# EasyEDA Pro project IMU-V2.eprj

# Schematic Schematic1
Create Date: 2023-02-26; Page Name: P1; Project Name: IMU-V2; Schematic Name: Schematic1; Update Date: 2023-03-20; Company: 嘉立创EDA; Page Size: A4; Version: V1.0
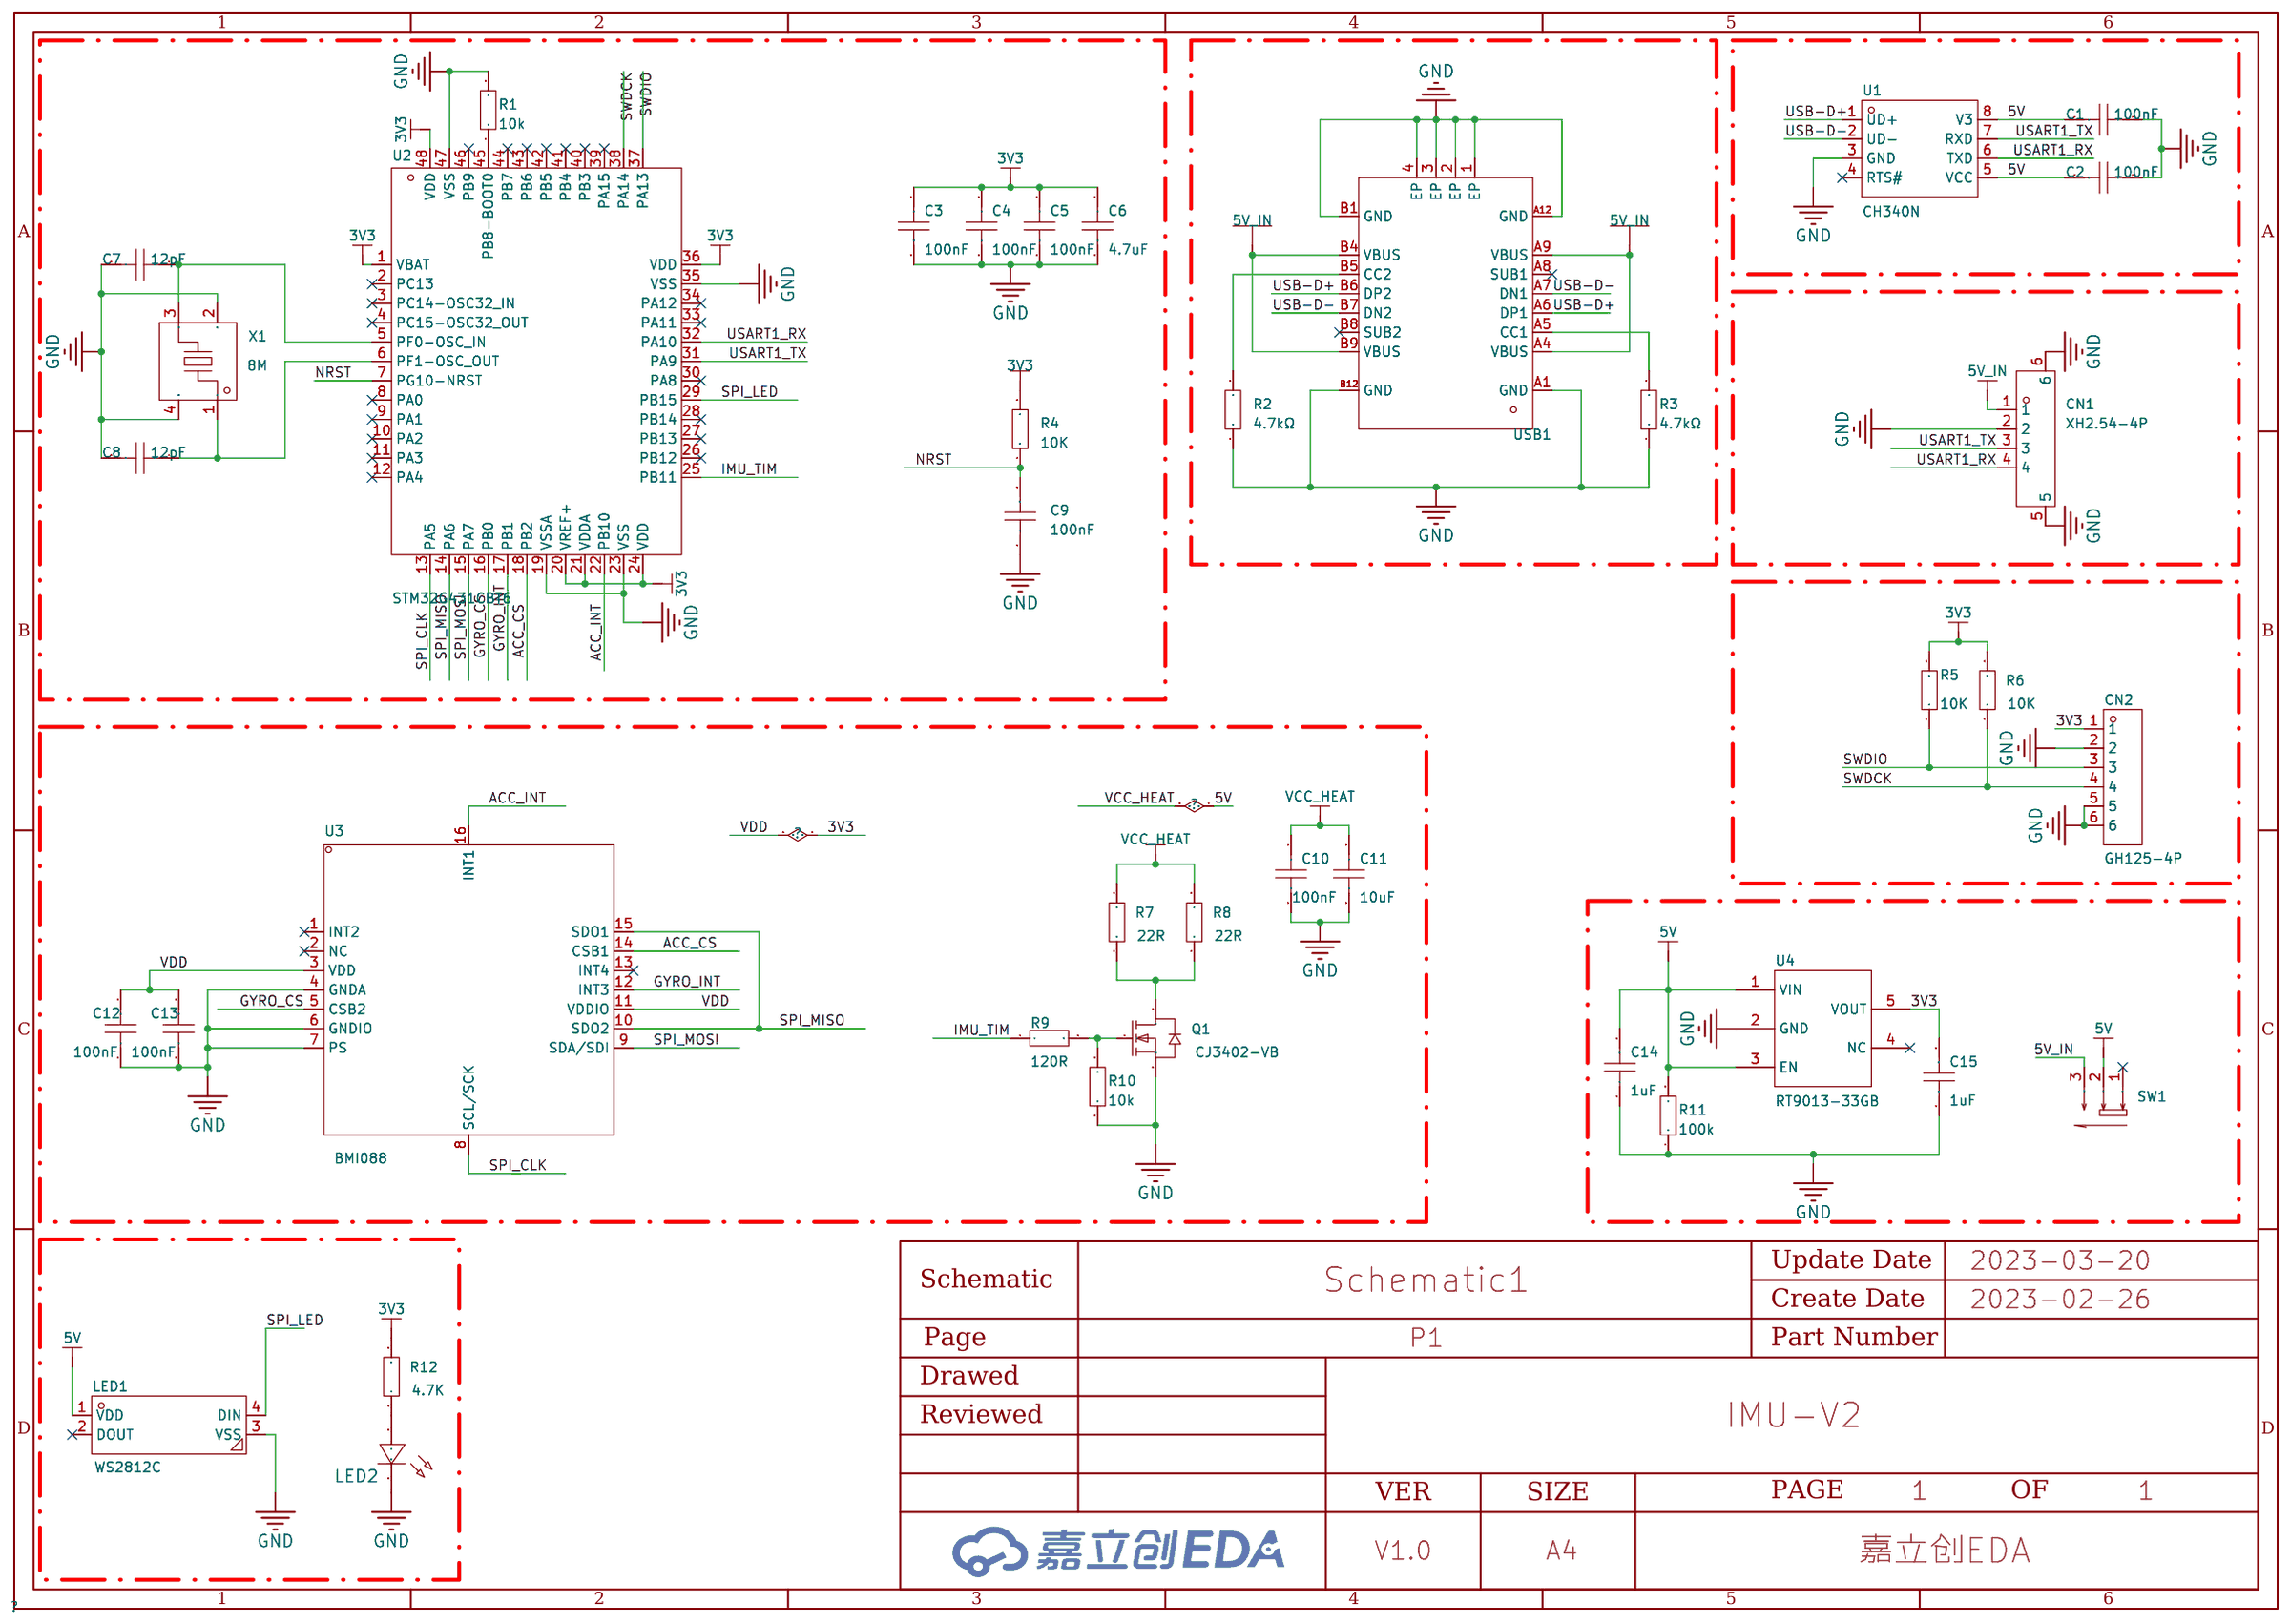
[diagram p0: schematic sheet]

## Parts
C1  100nF  [C0603_1]
C2  100nF  [C0603_1]
C3  100nF  [C0603]
C4  100nF  [C0603]
C5  100nF  [C0603]
C6  4.7uF  [C0603]
C7  12pF  [C0603]
C8  12pF  [C0603]
C9  100nF  [C0603_1]
C10  100nF  [C0603]
C11  10uF  [C0603]
C12  100nF  [C0603]
C13  100nF  [C0603]
C14  1uF  [C0603_1]
C15  1uF  [C0603_1]
CN1  XH2.54-4P  [CONN-TH_4P-P0.20_XUNPU_WAFER-XH2.54-4PWB]
CN2  GH125-4P  [CONN-SMD_4P-P1.27_GH125-S04DCA-00]
LED1  WS2812C  [LED-SMD_4P-L5.0-W5.0-LS5.4-TL-1]
LED2  -  [LED_0603]
Q1  CJ3402-VB  [SOT-23-3_L2.9-W1.6-P1.90-LS2.8-BR]
R1  10k  [R0603]
R2  4.7kΩ  [R0603]
R3  4.7kΩ  [R0603]
R4  10K  [R0603_2]
R5  10K  [R0603_3]
R6  10K  [R0603_3]
R7  22R  [R1206]
R8  22R  [R1206]
R9  120R  [R0603]
R10  10k  [R0603]
R11  100k  [R0603]
R12  4.7K  [R0603]
SW1  JS102011SAQN  [SW-SMD_JS102011SAQN]
U1  CH340N  [SOP-8_L4.9-W3.9-P1.27-LS6.0-BL]
U2  STM32G431CBT6  [LQFP-48_L7.0-W7.0-P0.50-LS9.0-BL_1]
U3  BMI088  [LGA-16_L4.5-W3.0-P0.50-BL]
U4  RT9013-33GB  [SOT-23-5_L3.0-W1.7-P0.95-LS2.8-BL]
USB1  -  [USB-C-SMD_KH-TYPE-C-16P_1]
X1  8M  [CRYSTAL-SMD_4P-L3.2-W2.5-BL_1]

## Library data of the parts
C1 C2 C9 C14 C15 = CAP_604: Supplier Footprint: 0603; Check: true
C3-C8 C10-C13 = CAP_0603: Supplier Footprint: 0603; Check: true
CN1 = WAFER-XH2.54-4PWB: LCSC Part Name: XH2.54mm 4P 卧贴; Supplier Part: C3029478; Manufacturer: XUNPU(讯普); Supplier Footprint: SMD,P=2.5mm; JLCPCB Part Class: Extended Part; Datasheet: https://atta.szlcsc.com/upload/public/pdf/source/20220527/7ACD2214A426F03D9ACD52F5A71E518C.pdf; Supplier: LCSC; Check: true
CN2 = GH125-S04DCA-00: 参考系列:-;间距:1.25mm;插针结构:1x4P;排数:1;每排PIN数:4;行距:-;公母:公型插针;安装方式:卧贴;额定电流:1A;工作温度范围:-25℃~+85℃;; LCSC Part Name: 1.25mm 1x4P 卧贴; Supplier Part: C2886767; Manufacturer: JS(钜硕电子); Supplier Footprint: SMD,P=1.25mm; JLCPCB Part Class: Extended Part; Datasheet: https://atta.szlcsc.com/upload/public/pdf/source/20210818/CD11791E5ED3EDF45A7009E9C8A2BD4C.pdf; Supplier: LCSC; Pitch: 1.25mm; Pins Structure: 1x4P; Number of Rows: 1; Number of PINs Per Row: 4; Gender: 公型插针; Mounting Style: 卧贴; Current Rating (Max): 1A; Operating Temperature Range: -25℃~+85℃; Check: true
LED1 = WS2812C: 发光颜色:RGB三色;; LCSC Part Name: RGB三色 （注意防潮，请查阅规格书中对应具体内容）; Supplier Part: C114587; Manufacturer: worldsemi; Supplier Footprint: SMD5050; JLCPCB Part Class: Extended Part; Datasheet: https://atta.szlcsc.com/upload/public/pdf/source/20171019/C114587_15083980074721044737.pdf; Supplier: LCSC; Emitted Color: RGB三色
LED2 = LED_0603-R: Supplier Footprint: 0603; Check: true
Q1 = CJ3402-VB: 类型:N沟道;漏源电压(Vdss):30V;连续漏极电流(Id):6.5A;功率(Pd):-;导通电阻(RDS(on)@Vgs,Id):30mΩ@10V,6.5A;阈值电压(Vgs(th)@Id):-;栅极电荷(Qg@Vgs):-;输入电容(Ciss@Vds):-;反向传输电容(Crss@Vds):-;; LCSC Part Name: N沟道 30V 6.5A; Supplier Part: C709940; Manufacturer: VBsemi(微碧); Supplier Footprint: SOT-23; JLCPCB Part Class: Extended Part; Datasheet: https://atta.szlcsc.com/upload/public/pdf/source/20200723/C709940_FC7E0D7FD36813A0D48B4CA5756C6C42.pdf; Supplier: LCSC; Type: N沟道; Drain Source Voltage (Vdss): 30V; Continuous Drain Current (Id): 6.5A; Drain Source On Resistance (RDS(on)@Vgs,Id): 30mΩ@10V,6.5A; Check: true
R1-R3 = RMC04025.1K5%N: 阻值:5.1kΩ;精度:±5%;功率:1/16W;; LCSC Part Name: 5.1kΩ ±5% 1/16W; Supplier Part: C325524; Manufacturer: Tyohm(幸亚电阻); Supplier Footprint: 0402; JLCPCB Part Class: Extended Part; Datasheet: https://atta.szlcsc.com/upload/public/pdf/source/20190115/C325524_522AE7765A4DE6F7DC0B90EDB62F83C2.pdf; Supplier: LCSC; Tolerance: ±5%; Power(Watts): 1/16W; Check: true
R4 = Res_605: Supplier Footprint: 0603; Check: true
R5 R6 = Res_606: Supplier Footprint: 0603
R7 R8 = Res_1206: Supplier Footprint: 1206
R9-R12 = Res_0603: Supplier Footprint: 0603; Check: true
SW1 = JS102011SAQN: 额定电流(DC):300mA;额定电压(DC):6V;额定电流(AC):-;额定电压(AC):-;电路结构:单刀双掷;安装方式:卧贴;机械寿命:5000;滑钮形状:矩形柱状;引脚样式:SMD接片;工作温度:-40℃~+85℃;开关高度:-;; Supplier Part: C221660; Manufacturer: C&K; Supplier Footprint: SMD; JLCPCB Part Class: Extended Part; Datasheet: https://atta.szlcsc.com/upload/public/pdf/source/20180724/C221660_DE1FE6FB2A421E3FF136514ED50A85B2.pdf; Supplier: LCSC; Current Rating (DC): 300mA; Voltage Rating (DC): 6V; Circuit: 单刀双掷; Mounting Style: 卧贴; Mechanical Life: 5000; Actuator Style: 矩形柱状; Pin Style: SMD接片; Operating Temperature: -40℃~+85℃
U1 = CH340N: Supplier Part: C2977777; Manufacturer: WCH(南京沁恒); Supplier Footprint: SOP-8; JLCPCB Part Class: Extended Part; Datasheet: https://atta.szlcsc.com/upload/public/pdf/source/20220223/82A45E4FF89B3EDCAD50B354450A7EF4.pdf; Supplier: LCSC; Check: true
U2 = STM32G431CBT6_1: CPU内核:ARM Cortex-M4;CPU最大主频:170MHz;工作电压范围:1.71V~3.6V;程序存储容量:128KB;RAM总容量:32KB;EEPROM/数据 FLASH容量:128KB;GPIO端口数量:38;ADC(位数):12bit;DAC(位数):12bit;(E)PWM(位数):-;外设/功能:DMA；PWM；看门狗;内部振荡器:有;工作温度范围:-40℃~+85℃;; LCSC Part Name: ARM Cortex-M4 170MHz; Supplier Part: C529355; Manufacturer: ST(意法半导体); Supplier Footprint: LQFP-48(7x7); JLCPCB Part Class: Extended Part; Datasheet: https://atta.szlcsc.com/upload/public/pdf/source/20200511/C529354_7C66CF00837B904D0C15DCE45B69418C.pdf; Supplier: LCSC; CPU Core: ARM Cortex-M4; CPU Maximum Speed: 170MHz; Operating Voltage Range: 1.71V~3.6V; Program Storage Size: 128KB; Program Memory Type: FLASH; RAM Size: 32KB; EEPROM: 128KB; GPIO Ports Number: 38; ADC (Bit): 12bit; DAC (Bit): 12bit; Peripheral/Function: DMA；PWM；看门狗; Internal Oscillator: 有; Operating Temperature Range: -40℃~+85℃
U3 = BMI088: Supplier Part: C194919; Manufacturer: Bosch(博世); Supplier Footprint: LGA-16; JLCPCB Part Class: Extended Part; Datasheet: https://atta.szlcsc.com/upload/public/pdf/source/20180628/C194919_66CCF125FF968C218A4D358C68AC68D6.pdf; Supplier: LCSC; Check: true
U4 = RT9013-33GB: 输出类型:固定;输出极性:正;输出通道数:1;最大输入电压:5.5V;输出电压:3.3V;压差:400mV@(500mA);静态电流(地电流):-;输出电流:500mA;电源纹波抑制比(PSRR):50dB@(10kHz);噪声:-;特性:-;; LCSC Part Name: 正 Vin=5.5V Vout=3.3V 500mA 50dB@(10kHz); Supplier Part: C47773; Manufacturer: RICHTEK(立锜); Supplier Footprint: SOT-23-5; JLCPCB Part Class: Extended Part; Datasheet: https://atta.szlcsc.com/upload/public/pdf/source/20150504/1457707282459.pdf; Supplier: LCSC; Output Type: 固定; Output Polarity: 正; Number of Outputs: 1; Maximum Input Voltage: 5.5V; Output Voltage: 3.3V; Dropout Voltage: 400mV@(500mA); Output Current: 500mA; Power Supply Rejection Ratio (PSRR): 50dB@(10kHz)
USB1 = kh-type-c-16p_2: Type-C母座 16PIN 立式四角贴板无压片; LCSC Part Name: Type-C母座; Supplier Part: C709357; Manufacturer: kinghelm(金航标); Manufacturer Part: KH-TYPE-C-16P; LCSC Stock: 5637; LCSC On Sale: 1; Price: 0.484; JLCPCB Part Class: Extended Part; JLCPCB Stock: 2220; JLCPCB On Sale: 1; Datasheet: https://atta.szlcsc.com/upload/public/pdf/source/20200911/C709357_AA8DCEB38BB20E3035A7ED7AE7667837.pdf; Supplier: LCSC; Check: true
X1 = 3225-12-16-10-10/A_1: 工作温度-40℃~+95℃; LCSC Part Name: 3225-12-16-10-10/A; Supplier Part: C2981641; Manufacturer: LIMING(利明); Supplier Footprint: SMD3225-4P; JLCPCB Part Class: Extended Part; Datasheet: https://atta.szlcsc.com/upload/public/pdf/source/20220322/0ABBC579650689231413FB26C3617F3F.pdf; Supplier: LCSC; Check: true

## Nets
3V3: C3.1 C4.1 C5.1 C6.1 C12.2 C13.2 C15.2 CN2.1 R4.2 R5.2 R6.2 R12.2 U2.1(VBAT) U2.20(VREF+) U2.21(VDDA) U2.24(VDD) U2.36(VDD) U2.48(VDD) U3.3(VDD) U3.11(VDDIO) U4.5(VOUT)
5V: C1.2 C2.2 C10.1 C11.1 C14.2 LED1.1(VDD) R7.2 R8.2 R11.2 SW1.2 U1.5(VCC) U1.8(V3) U4.1(VIN) U4.3(EN)
5V_IN: CN1.1 SW1.3 USB1.A4(VBUS) USB1.A9(VBUS) USB1.B4(VBUS) USB1.B9(VBUS)
GND: C1.1 C2.1 C3.2 C4.2 C5.2 C6.2 C7.2 C8.2 C9.1 C10.2 C11.2 C12.1 C13.1 C14.1 C15.1 CN1.2 CN1.5 CN1.6 CN2.2 CN2.5 CN2.6 LED1.3(VSS) LED2.1(C) Q1.2(S) R1.2 R2.1 R3.1 R10.1 R11.1 U1.3(GND) U2.19(VSSA) U2.23(VSS) U2.35(VSS) U2.47(VSS) U3.4(GNDA) U3.6(GNDIO) U3.7(PS) U4.2(GND) USB1.1(EP) USB1.2(EP) USB1.3(EP) USB1.4(EP) USB1.A1(GND) USB1.A12(GND) USB1.B1(GND) USB1.B12(GND) X1.2(GND) X1.4(GND)
ACC_CS: U2.18(PB2) U3.14(CSB1)
ACC_INT: U2.22(PB10) U3.16(INT1)
GYRO_CS: U2.16(PB0) U3.5(CSB2)
GYRO_INT: U2.17(PB1) U3.12(INT3)
IMU_TIM: R9.1 U2.25(PB11)
NRST: C9.2 R4.1 U2.7(PG10-NRST)
SPI_CLK: U2.13(PA5) U3.8(SCL/SCK)
SPI_LED: LED1.4(DIN) U2.29(PB15)
SPI_MISO: U2.14(PA6) U3.10(SDO2) U3.15(SDO1)
SPI_MOSI: U2.15(PA7) U3.9(SDA/SDI)
SWDCK: CN2.4 R6.1 U2.38(PA14)
SWDIO: CN2.3 R5.1 U2.37(PA13)
USART1_RX: CN1.4 U1.6(TXD) U2.32(PA10)
USART1_TX: CN1.3 U1.7(RXD) U2.31(PA9)
USB-D+: U1.1(UD+) USB1.A6(DP1) USB1.B6(DP2)
USB-D-: U1.2(UD-) USB1.A7(DN1) USB1.B7(DN2)
$Q1_1: Q1.1(G) R9.2 R10.2
$Q1_3: Q1.3(D) R7.1 R8.1
Net-(C7-1): C7.1 U2.5(PF0-OSC_IN) X1.3
Net-(C8-1): C8.1 U2.6(PF1-OSC_OUT) X1.1
Net-(LED2-2): LED2.2(A) R12.1
Net-(R1-1): R1.1 U2.45(PB8-BOOT0)
Net-(R2-2): R2.2 USB1.B5(CC2)
Net-(R3-2): R3.2 USB1.A5(CC1)

Not connected (* = marked no-connect by the designer): LED1 2(DOUT)*; SW1 1*; U1 4(RTS#)*; U2 2(PC13)* 3(PC14-OSC32_IN)* 4(PC15-OSC32_OUT)* 8(PA0)* 9(PA1)* 10(PA2)* 11(PA3)* 12(PA4)* 26(PB12)* 27(PB13)* 28(PB14)* 30(PA8)* 33(PA11)* 34(PA12)* 39(PA15)* 40(PB3)* 41(PB4)* 42(PB5)* 43(PB6)* 44(PB7)* 46(PB9)*; U3 1(INT2)* 2(NC)* 13(INT4)*; U4 4(NC)*; USB1 A8(SUB1)* B8(SUB2)*

# Board PCB1
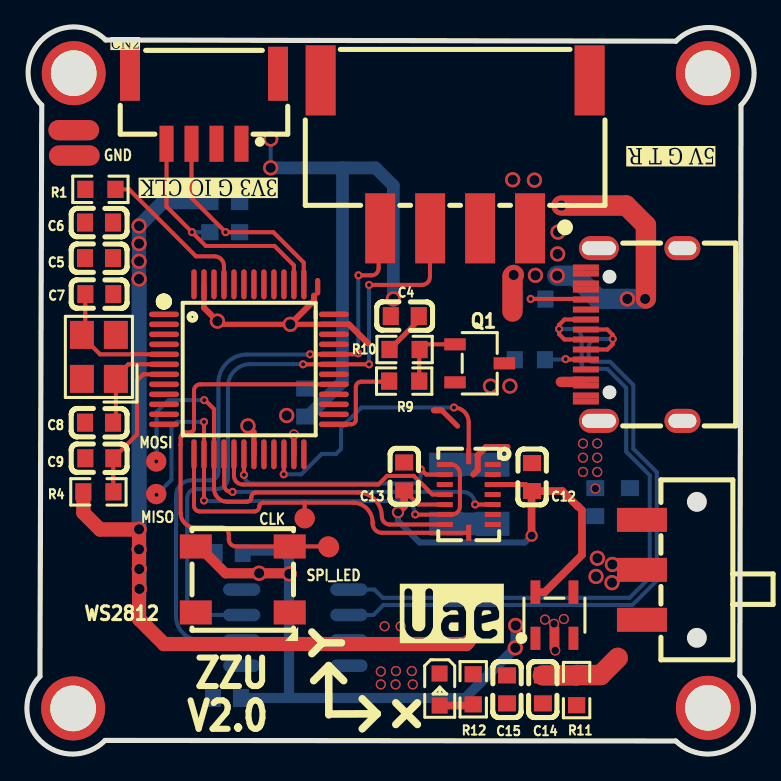
[diagram p1: board, top side]
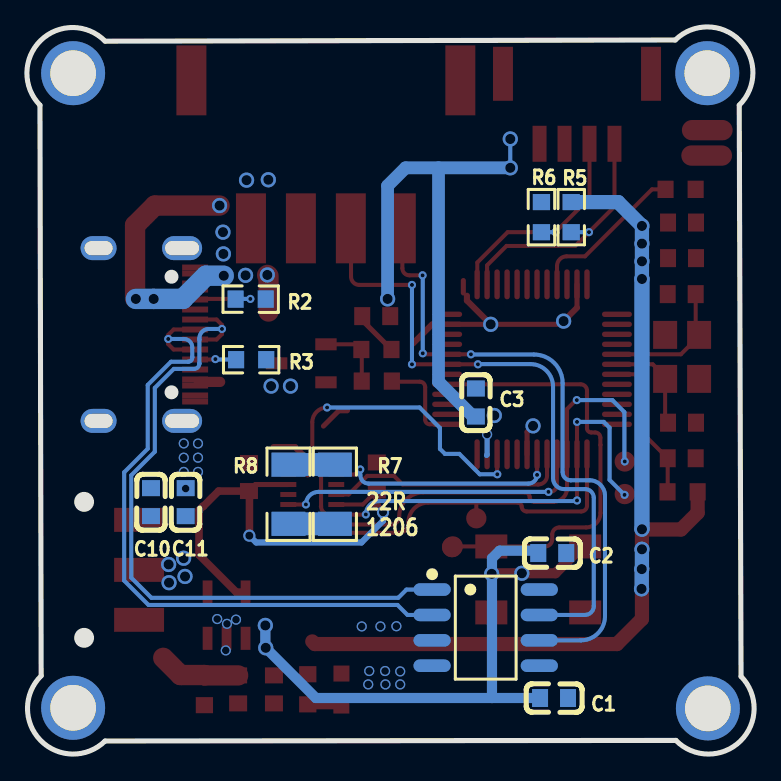
[diagram p2: board, bottom side, seen from below]

Outline 36.4 x 36.37 mm; copper layers: Top Layer, Bottom Layer. Coordinates in mm from the lower left corner of the outline.
Outline path: 0.65,3.88 0.74,32.45 arc(0.71,35.68) 3.94,35.71 32.48,35.65 arc(35.71,35.68) 35.74,32.45 35.68,3.91 arc(35.71,0.68) 32.48,0.65 3.91,0.68 arc(0.68,0.65) 0.65,3.88
Stack: Top Layer 0.035mm / Dielectric1 1.51mm FR4 er 4.5 / Bottom Layer 0.035mm

## Design rules (mm)
net 3V3: PWR
net GND: PWR
net 5V: PWR
net USB-D+: DP1
net USB-D-: DP1
net 5V_IN: PWR
spacing safeClearance (default): track to track 0.152, other pairs 0 to 0.381
track width trackWidth (default): min 0.127, default 0.203, max 2.54
differential pair differentialPair (default): width min 0.127, default 0.254, max 2.54; gap min 0.152, default 0.152
via viaSize (default): diameter min 0.406, default 0.61, max 10; hole min 0.203, default 0.305, max 5.999

## Placement (name value [footprint] x y rotation side)
C1  100nF  [C0603_1]  10.01 2.8 0 bottom
C2  100nF  [C0603_1]  10.1 10.05 0 bottom
C3  100nF  [C0603]  13.92 17.58 90 bottom
C4  100nF  [C0603]  18.91 21.9 0 top
C5  100nF  [C0603]  3.6 24.8 180 top
C6  4.7uF  [C0603]  3.6 26.58 180 top
C7  12pF  [C0603]  3.62 23 0 top
C8  12pF  [C0603]  3.6 16.57 180 top
C9  100nF  [C0603_1]  3.62 14.79 0 top
C10  100nF  [C0603]  30.18 12.6 90 bottom
C11  10uF  [C0603]  28.45 12.6 90 bottom
C12  100nF  [C0603]  25.28 13.85 270 top
C13  100nF  [C0603]  18.88 13.88 270 top
C14  1uF  [C0603_1]  25.82 3.23 90 top
C15  1uF  [C0603_1]  24.03 3.23 90 top
CN2  GH125-4P  [CONN-SMD_4P-P1.27_GH125-S04DCA-00]  8.86 32.27 180 top
NOREF  -  [Pad_e130]  2.34 31.2 0 top
NOREF#2  -  [LQFP-48_L7.0-W7.0-P0.50-LS9.0-BL_1]  11.11 19.24 270 top
NOREF#3  -  [Pad_e132]  2.37 29.93 0 top
NOREF#4  -  [Pad_e1031]  15.11 10.35 90 top
NOREF#5  -  [USB-C-SMD_KH-TYPE-C-16P_1]  30.39 20.98 90 top
NOREF#6  -  [Pad_e1283]  6.47 14.63 90 top
NOREF#7  -  [LED_0603]  20.66 3.17 270 top
NOREF#8  -  [Pad_e926]  34.08 2.31 180 top
NOREF#9  -  [Pad_e924]  34.08 34.05 270 top
NOREF#10  -  [Pad_e916]  2.31 2.28 90 top
NOREF#11  -  [Pad_e1282]  6.47 13 90 top
NOREF#12  -  [LGA-16_L4.5-W3.0-P0.50-BL]  22.11 12.98 180 top
NOREF#13  -  [Pad_e1159]  13.9 11.79 90 top
NOREF#14  -  [Pad_e922]  2.34 34.05 0 top
NOREF#15  -  [CONN-TH_4P-P0.20_XUNPU_WAFER-XH2.54-4PWB]  21.43 29.99 180 top
NOREF#16  -  [SOT-23-5_L3.0-W1.7-P0.95-LS2.8-BL]  26.4 6.94 0 top
NOREF#17  -  [SW-SMD_JS102011SAQN]  30.78 9.21 90 top
NOREF#18  -  [SOP-8_L4.9-W3.9-P1.27-LS6.0-BL]  13.43 6.32 270 bottom
Q1  CJ3402-VB  [SOT-23-3_L2.9-W1.6-P1.90-LS2.8-BR]  22.66 19.54 180 top
R1  10k  [R0603]  3.68 28.24 180 top
R2  4.7kΩ  [R0603]  25.19 22.75 0 bottom
R3  4.7kΩ  [R0603]  25.17 19.72 0 bottom
R4  10K  [R0603_2]  3.58 13.11 180 top
R5  10K  [R0603_3]  10.64 26.85 90 bottom
R6  10K  [R0603_3]  9.15 26.85 90 bottom
R7  22R  [R1206]  20.98 12.99 270 bottom
R8  22R  [R1206]  23.3 12.99 270 bottom
R9  120R  [R0603]  18.88 18.65 0 top
R10  10k  [R0603]  18.9 20.23 0 top
R11  100k  [R0603]  27.51 3.2 90 top
R12  4.7K  [R0603]  22.34 3.24 90 top
WS2812  WS2812C  [LED-SMD_4P-L5.0-W5.0-LS5.4-TL-1]  10.8 8.73 0 top
X1  8M  [CRYSTAL-SMD_4P-L3.2-W2.5-BL_1]  3.6 19.86 90 top

## Footprints (pads in the part's own frame, mm; a bottom-side part is the same pattern mirrored in y, then rotated)
C0603
  rect 0.8x0.9 smd: 1(-0.7,0) 2(0.7,0)
C0603_1
  rect 0.8x0.9 smd: 1(-0.7,0) 2(0.7,0)
CONN-SMD_4P-P1.27_GH125-S04DCA-00
  rect 0.7x1.8 smd: 1(-1.875,1.75) 2(-0.625,1.75) 3(0.625,1.75) 4(1.875,1.75)
  rect 1x2.7 smd: 5(3.705,-1.75) 6(-3.705,-1.75)
CONN-TH_4P-P0.20_XUNPU_WAFER-XH2.54-4PWB
  rect 1.5x3.5 smd: 1(-3.75,3.7) 2(-1.25,3.7) 3(1.25,3.7) 4(3.75,3.7) 5(-6.73,-3.7) 6(6.73,-3.7)
CRYSTAL-SMD_4P-L3.2-W2.5-BL_1
  rect 1.4x1.2 smd: 1(-1.1,-0.85) 2(1.1,-0.85) 3(1.1,0.85) 4(-1.1,0.85)
LED-SMD_4P-L5.0-W5.0-LS5.4-TL-1
  rect 1.6x1.2 smd: 1(-2.35,1.65) 2(-2.35,-1.65) 3(2.35,-1.65) 4(2.35,1.65)
LED_0603
  rect 0.8x0.8 smd: 1(-0.851,-0.01) 2(0.75,-0.005)
LGA-16_L4.5-W3.0-P0.50-BL
  rect 0.8x0.25 smd: 1(-1.2,-1.498) 2(-1.2,-0.998) 3(-1.2,-0.498) 4(-1.2,0.002) 5(-1.2,0.502) 6(-1.2,1.002) 7(-1.2,1.502) 9(1.2,1.502) 10(1.2,1.002) 11(1.2,0.502) 12(1.2,0.002) 13(1.2,-0.498) 14(1.2,-0.998) 15(1.2,-1.498)
  rect 0.25x0.8 smd: 8(0,1.915) 16(0,-1.915)
LQFP-48_L7.0-W7.0-P0.50-LS9.0-BL_1
  oval 0.27x1.5 smd: 1(-2.75,-4.25) 2(-2.25,-4.25) 3(-1.75,-4.25) 4(-1.25,-4.25) 5(-0.75,-4.25) 6(-0.25,-4.25) 7(0.25,-4.25) 8(0.75,-4.25) 9(1.25,-4.25) 10(1.75,-4.25) 11(2.25,-4.25) 12(2.75,-4.25) 25(2.75,4.25) 26(2.25,4.25) 27(1.75,4.25) 28(1.25,4.25) 29(0.75,4.25) 30(0.25,4.25) 31(-0.25,4.25) 32(-0.75,4.25) 33(-1.25,4.25) 34(-1.75,4.25) 35(-2.25,4.25) 36(-2.75,4.25)
  oval 1.5x0.27 smd: 13(4.25,-2.75) 14(4.25,-2.25) 15(4.25,-1.75) 16(4.25,-1.25) 17(4.25,-0.75) 18(4.25,-0.25) 19(4.25,0.25) 20(4.25,0.75) 21(4.25,1.25) 22(4.25,1.75) 23(4.25,2.25) 24(4.25,2.75) 37(-4.25,2.75) 38(-4.25,2.25) 39(-4.25,1.75) 40(-4.25,1.25) 41(-4.25,0.75) 42(-4.25,0.25) 43(-4.25,-0.25) 44(-4.25,-0.75) 45(-4.25,-1.25) 46(-4.25,-1.75) 47(-4.25,-2.25) 48(-4.25,-2.75)
Pad_e130
  oval 2.54x1.016 smd: TP1(0,0)
Pad_e132
  oval 2.54x1.016 smd: TP1(0,0)
Pad_e916
  round 3.2 hole 2.286: 1(0,0)
Pad_e922
  round 3.2 hole 2.286: 1(0,0)
Pad_e924
  round 3.2 hole 2.286: 1(0,0)
Pad_e926
  round 3.2 hole 2.286: 1(0,0)
Pad_e1031
  round 1.016 smd: TP3(0,0)
Pad_e1159
  round 1.016 smd: TP3(0,0)
Pad_e1282
  round 1.016 smd: TP3(0,0)
Pad_e1283
  round 1.016 smd: TP3(0,0)
R0603
  rect 0.806x0.864 smd: 1(-0.753,0) 2(0.753,0)
R0603_2
  rect 0.806x0.864 smd: 1(-0.753,0) 2(0.753,0)
R0603_3
  rect 0.806x0.864 smd: 1(-0.753,0) 2(0.753,0)
R1206
  rect 1.208x1.701 smd: 1(-1.479,0) 2(1.479,0)
SOP-8_L4.9-W3.9-P1.27-LS6.0-BL
  oval 0.63x1.865 smd: 1(-1.905,-2.683) 2(-0.635,-2.683) 3(0.635,-2.683) 4(1.905,-2.683) 5(1.905,2.683) 6(0.635,2.683) 7(-0.635,2.683) 8(-1.905,2.683)
SOT-23-3_L2.9-W1.6-P1.90-LS2.8-BR
  rect 1.07x0.6 smd: 1(1.235,-0.95) 2(1.235,0.95) 3(-1.235,0)
SOT-23-5_L3.0-W1.7-P0.95-LS2.8-BL
  rect 0.49x1.157 smd: 1(-0.95,-1.153) 2(0,-1.153) 3(0.95,-1.153)
  rect 0.49x1.175 smd: 4(0.95,1.153) 5(-0.95,1.153)
SW-SMD_JS102011SAQN
  rect 1.2x2.5 smd: 1(-2.5,0) 2(0,0) 3(2.5,0)
USB-C-SMD_KH-TYPE-C-16P_1
  oval 1.2x2 hole 0.7x1.7: 1(-4.32,1.765) 2(4.32,1.765)
  oval 1.2x1.8 hole 0.7x1.4: 3(-4.32,-2.415) 4(4.32,-2.415)
  rect 0.3x1.3 smd: A1(-3.35,2.415) A4(-2.55,2.415) A5(-1.25,2.415) A6(-0.25,2.415) A7(0.25,2.415) A8(1.25,2.415) A9(2.55,2.415) A12(3.35,2.415) B1(3.05,2.415) B4(2.25,2.415) B5(1.75,2.415) B6(0.75,2.415) B7(-0.75,2.415) B8(-1.75,2.415) B9(-2.25,2.415) B12(-3.05,2.415)

## Nets
3V3: C3.1 C4.1 C5.1 C6.1 C12.2 C13.2 C15.2 CN2.1 NOREF#2.1 NOREF#2.20 NOREF#2.21 NOREF#2.24 NOREF#2.36 NOREF#2.48 NOREF#12.3 NOREF#12.11 NOREF#16.5 R4.2 R5.2 R6.2 R12.2
5V: C1.2 C2.2 C10.1 C11.1 C14.2 NOREF#16.1 NOREF#16.3 NOREF#17.2 NOREF#18.5 NOREF#18.8 R7.2 R8.2 R11.2 WS2812.1
5V_IN: NOREF#5.A4 NOREF#5.A9 NOREF#5.B4 NOREF#5.B9 NOREF#15.1 NOREF#17.3
GND: C1.1 C2.1 C3.2 C4.2 C5.2 C6.2 C7.2 C8.2 C9.1 C10.2 C11.2 C12.1 C13.1 C14.1 C15.1 CN2.2 CN2.5 CN2.6 NOREF.TP1 NOREF#2.19 NOREF#2.23 NOREF#2.35 NOREF#2.47 NOREF#3.TP1 NOREF#5.1 NOREF#5.2 NOREF#5.3 NOREF#5.4 NOREF#5.A1 NOREF#5.A12 NOREF#5.B1 NOREF#5.B12 NOREF#7.1 NOREF#12.4 NOREF#12.6 NOREF#12.7 NOREF#15.2 NOREF#15.5 NOREF#15.6 NOREF#16.2 NOREF#18.3 Q1.2 R1.2 R2.1 R3.1 R10.1 R11.1 WS2812.3 X1.2 X1.4
$C7_1: C7.1 NOREF#2.5 X1.3
$C8_1: C8.1 NOREF#2.6 X1.1
$LED2_2: NOREF#7.2 R12.1
$Q1_1: Q1.1 R9.2 R10.2
$Q1_3: Q1.3 R7.1 R8.1
$R1_1: NOREF#2.45 R1.1
$R2_2: NOREF#5.B5 R2.2
$R3_2: NOREF#5.A5 R3.2
ACC_CS: NOREF#2.18 NOREF#12.14
ACC_INT: NOREF#2.22 NOREF#12.16
GYRO_CS: NOREF#2.16 NOREF#12.5
GYRO_INT: NOREF#2.17 NOREF#12.12
IMU_TIM: NOREF#2.25 R9.1
NRST: C9.2 NOREF#2.7 R4.1
SPI_CLK: NOREF#2.13 NOREF#12.8 NOREF#13.TP3
SPI_LED: NOREF#2.29 NOREF#4.TP3 WS2812.4
SPI_MISO: NOREF#2.14 NOREF#11.TP3 NOREF#12.10 NOREF#12.15
SPI_MOSI: NOREF#2.15 NOREF#6.TP3 NOREF#12.9
SWDCK: CN2.4 NOREF#2.38 R6.1
SWDIO: CN2.3 NOREF#2.37 R5.1
USART1_RX: NOREF#2.32 NOREF#15.4 NOREF#18.6
USART1_TX: NOREF#2.31 NOREF#15.3 NOREF#18.7
USB-D+: NOREF#5.A6 NOREF#5.B6 NOREF#18.1
USB-D-: NOREF#5.A7 NOREF#5.B7 NOREF#18.2

Pads without a net: NOREF#2 2 3 4 8 9 10 11 12 26 27 28 30 33 34 39 40 41 42 43 44 46; NOREF#5 A8 B8; NOREF#8 1; NOREF#9 1; NOREF#10 1; NOREF#12 1 2 13; NOREF#14 1; NOREF#16 4; NOREF#17 1; NOREF#18 4; WS2812 2

## Via types
v1: diameter 0.406, hole 0.203, Top Layer to Bottom Layer, 24 vias
v2: diameter 0.762, hole 0.508, Top Layer to Bottom Layer, 35 vias
v3: diameter 0.61, hole 0.406, Top Layer to Bottom Layer, 2 vias
v4: diameter 0.508, hole 0.381, Top Layer to Bottom Layer, 21 vias

## Routing (per net, layer and track width the routed paths; a pad name or vN(x,y) marks a point on that pad's centre or on a via; arc(x,y) is an arc through that point)
3V3: length 97.6
  Top Layer w0.203: NOREF#12.11 19.58,12.48 C13.2
  Top Layer w0.254: C12.2 24.95,13.48 NOREF#12.3
  Top Layer w0.381: v3(25.26,10.92) 25.25,10.93 25.25,13.13 C12.2 26.8,13.15 27.56,12.39 27.58,12.39 27.78,12.19 27.78,9.96 25.91,8.09 NOREF#16.5 ; v3(18.57,12.09) 18.88,12.4 C13.2
  Top Layer w0.711: R4.2 2.82,12.06 3.65,11.23 5.6,11.23 ; v2(5.61,11.24) v2(5.61,10.24) 5.61,6.75 6.86,5.5 21.98,5.5 22.11,5.63
  Top Layer w0.762: 5.6,11.23 v2(5.61,11.24)
  Bottom Layer w0.203: v2(12.2,30.76) v2(12.2,29.32)
  Bottom Layer w0.305: v3(18.57,12.09) 18.57,11.66 19.65,10.58 24.92,10.58 v3(25.26,10.92)
  Bottom Layer w0.635: v2(18.34,22.76) 18.34,28.42 17.44,29.32 15.79,29.32 ; v2(12.2,29.32) 15.79,29.32 ; 15.79,29.32 15.79,18.61 14.06,16.88 C3.1
  Bottom Layer w0.711: R6.2 6.8,27.6 v2(5.61,26.41) v2(5.61,25.53) v2(5.61,24.64) v2(5.61,23.76) ; v2(5.63,8.26) 5.62,8.27 v2(5.62,9.25) 5.61,9.26 v2(5.61,10.24)
  Bottom Layer w0.762: v2(5.61,23.76) 5.61,11.27
  vias: v2(13,16.93)
5V: length 37.1
  Top Layer w0.508: WS2812.1 8.6,10.38 9.94,9.04 v2(11.62,9.04) 13.1,9.04 v2(13.13,9.01)
  Top Layer w1.016: C14.2 27.49,3.93 R11.2 28.71,3.95 29.57,4.81
  Bottom Layer w0.508: v2(24.46,6.43) 24.46,5.33 v2(24.44,5.31) 21.93,2.8 13.12,2.8 ; 13.12,2.8 C1.2 ; 13.12,2.8 13.12,9.78 12.73,10.17 10.92,10.17 C2.2
  Bottom Layer w1.143: R7.2 R8.2
  vias: v2(28.55,9.79) v2(28.48,8.88) v2(29.3,9.48) v2(29.28,8.57)
5V_IN: length 16
  Top Layer w0.508: 26.72,18.61 27.8,18.61
  Top Layer w1.016: v2(26.75,27.43) 29.99,27.43 30.98,26.44 30.98,22.78 ; 24.3,22.13 24.3,23.9 ; v2(24.36,23.96) 24.37,23.95
  Bottom Layer w1.016: v2(26.54,23.92) 27.43,23.92 28.59,22.76 v2(30.05,22.76) v2(30.94,22.76)
  vias: v2(24.31,28.72) v2(25.4,28.7) v2(25.45,23.94) v2(26.56,25.01) v2(26.58,26.1)
GND: length 22.7
  Top Layer w0.254: NOREF#2.47 8.86,22.32 ; 16.11,21.49 NOREF#2.35 v2(13.18,21.49) 9.69,21.49 v2(9.53,21.65) ; R10.1 19.61,21.69 C4.2 ; v2(11.06,16.41) 11.36,16.11 NOREF#2.19 ; 21.55,16.4 20.76,17.19 ; v4(13.36,15.98) NOREF#2.23 ; 14.55,23.06 14.55,23.68
  Top Layer w0.305: 24.05,15.35 22.97,15.35 22.56,14.94 22.56,14.2 22.34,13.98 ; 20.76,17.19 20.37,17.19 ; 14.37,22.92 14.37,22.68 v2(13.18,21.49) ; 8.86,22.32 v2(9.53,21.65) ; 16.11,21.49 17.06,20.54
  Bottom Layer w0.254: 13.39,14.93 13.36,14.96 v4(13.36,15.98)
  vias: v4(17.71,4.13) v4(17.71,3.48) v4(17.9,6.39) v4(18.45,3.48) v4(18.47,4.15) v4(18.7,6.38) v4(19.26,4.15) v4(19.31,3.48) v4(19.64,6.38) v4(25.93,6.72) v4(26.38,6.51) v4(26.44,5.18) v4(26.87,6.75) v4(27.83,15.53) v4(27.83,14.82) v4(27.83,14.11) v4(28.45,13.27) v4(28.54,15.53) v4(28.54,14.82) v4(28.54,14.11)
$C7_1: length 6.6
  Top Layer w0.203: 2.75,20.9 3.66,19.99 6.85,19.99 ; X1.3 2.92,21.13 C7.1 ; NOREF#2.5 6.85,20
$C8_1: length 5
  Top Layer w0.203: C8.1 4.45,16.72 X1.1 4.45,18.87 5.07,19.49 NOREF#2.6
$LED2_2: length 1.7
  Top Layer w0.305: 22.28,2.42 arc(22.32,2.44) R12.1
  Top Layer w0.381: NOREF#7.2 22.28,2.42
$Q1_1: length 3.5
  Top Layer w0.203: R9.2 19.63,20.21 R10.2 19.91,20.49 21.43,20.49
$Q1_3: length 2.3
  Bottom Layer w1.143: 20.91,14.48 23.23,14.48
  vias: v2(23.2,18.4) v2(24.17,18.4)
$R1_1: length 8
  Top Layer w0.203: R1.1 5.11,28.24 8.46,24.89 9.38,24.89 arc(9.72,24.75) 9.86,24.41 NOREF#2.45
$R2_2: length 3.5
  Top Layer w0.203: v1(25.21,22.76) 27.95,22.76 27.97,22.73
  Bottom Layer w0.203: v1(25.21,22.76) 25.94,22.76 R2.2
$R3_2: length 2
  Top Layer w0.203: 27.97,19.73 26.98,19.73 v1(26.96,19.75)
  Bottom Layer w0.203: v1(26.96,19.75) 26.94,19.73 26,19.73
ACC_CS: length 11.9
  Top Layer w0.203: NOREF#12.14 19.98,13.98 19.73,14.23 v1(19.71,14.23) ; v1(10.86,13.96) NOREF#2.18
  Bottom Layer w0.203: v1(19.71,14.23) 19.71,13.94 ; v1(10.86,13.96) arc(10.99,13.65) 11.29,13.53 19.3,13.53 arc(19.58,13.64) 19.7,13.93
ACC_INT: length 14.4
  Top Layer w0.203: v1(12.85,13.99) 12.86,14 NOREF#2.22 ; NOREF#12.16 22.11,16.59 arc(21.89,17.11) v1(21.37,17.33)
  Bottom Layer w0.203: 21.34,17.33 16.74,17.33 15.72,16.31 15.72,15.26 15.47,15.01 14.75,15.01 13.73,13.99 v1(12.85,13.99)
GYRO_CS: length 15.5
  Top Layer w0.203: NOREF#12.5 23.31,12.48 v1(22.43,12.48) ; NOREF#2.16 9.87,14.98 9.87,13.45 arc(9.97,13.21) 10.21,13.11 v1(10.29,13.11)
  Bottom Layer w0.203: v1(10.29,13.11) 21.8,13.11 arc(22.25,12.93) v1(22.43,12.48)
GYRO_INT: length 12.4
  Top Layer w0.203: 10.37,14.98 NOREF#2.17 ; NOREF#12.12 20.29,12.98 19.36,13.91 18.02,13.91 17.59,13.48 10.8,13.48 arc(10.49,13.61) 10.36,13.92 10.36,14.98
IMU_TIM: length 4.7
  Top Layer w0.203: NOREF#2.25 16.23,16.49 arc(16.39,16.56) 16.46,16.72 16.46,18.35 arc(16.54,18.54) 16.73,18.62 18.1,18.62 ; 18.08,18.6 18.1,18.62 ; 18.1,18.62 arc(18.12,18.63) R9.1
NRST: length 7.5
  Top Layer w0.203: NOREF#2.7 5.82,18.99 5.51,18.68 5.51,15.98 C9.2 4.32,13.12 R4.1
SPI_CLK: length 18.4
  Top Layer w0.203: 13.9,12.57 11.82,12.57 arc(11.69,12.51) 11.63,12.38 arc(11.56,12.2) 11.38,12.13 8.65,12.13 arc(8.44,12.22) 8.36,12.42 NOREF#2.13 ; 13.9,12.57 16.31,12.57 arc(17.01,12.28) 17.3,11.58 17.3,11.53 arc(17.44,11.2) 17.77,11.07 NOREF#12.8 ; 13.9,12.57 arc(13.9,12.57) 13.9,12.57 ; NOREF#13.TP3 13.9,12.57
SPI_LED: length 22.3
  Top Layer w0.203: 8.36,17.94 8.36,16.29 arc(8.3,16.14) 8.15,16.08 7.95,16.08 arc(7.77,16) 7.69,15.82 7.69,15.46 7.69,15.46 7.69,12.05 arc(7.9,11.54) 8.41,11.33 9.75,11.33 arc(10,11.23) 10.1,10.98 10.1,10.74 arc(10.21,10.49) 10.46,10.38 WS2812.4 15.08,10.38 ; NOREF#2.29 8.68,18.49 arc(8.45,18.4) 8.36,18.17 8.36,17.95 arc(8.36,17.94) 8.37,17.94
  Top Layer w1.016: NOREF#4.TP3 15.08,10.38
SPI_MISO: length 25.4
  Top Layer w0.203: 21.67,13.98 21.67,12.39 arc(21.67,12.38) 21.68,12.38 ; v1(8.86,16.61) NOREF#2.14 v1(8.86,12.68) 8.85,12.67 ; 21.28,11.98 NOREF#12.10 20.9,11.97 19.44,11.97 v1(19.43,11.98) ; NOREF#12.15 21.17,14.48 ; 21.17,14.5 arc(21.52,14.35) 21.67,14 ; 21.67,12.38 arc(21.55,12.1) 21.27,11.98
  Bottom Layer w0.203: 8.89,12.66 8.9,12.65 18.76,12.65 arc(19.23,12.45) v1(19.43,11.98) ; v1(6.48,12.96) 7.23,13.71 7.23,16.32 7.52,16.61 v1(8.86,16.61)
SPI_MOSI: length 22.8
  Top Layer w0.203: NOREF#12.9 18.16,11.48 arc(17.88,11.6) 17.76,11.88 arc(17.41,12.73) 16.56,13.08 11.46,13.08 arc(11.3,13.01) 11.23,12.85 arc(11.16,12.68) 10.99,12.61 10.04,12.61 arc(9.56,12.81) 9.36,13.29 NOREF#2.15 9.36,17.25 8.91,17.7 v1(8.87,17.7)
  Bottom Layer w0.203: 6.48,14.65 6.49,14.66 6.49,17.1 7.09,17.7 v1(8.87,17.7)
  vias: v1(6.47,14.63)
SWDCK: length 12.6
  Top Layer w0.203: NOREF#2.38 13.36,24.44 12.39,25.41 8.95,25.41 v1(8.26,26.1) 6.99,27.38 CN2.4
  Bottom Layer w0.203: R6.1 9.15,26.1 v1(8.26,26.1)
SWDIO: length 11.5
  Top Layer w0.203: CN2.3 8.24,27.81 v1(9.94,26.1) 12.33,26.1 13.85,24.58 13.85,23.5 NOREF#2.37
  Bottom Layer w0.203: R5.1 10.64,26.1 v1(9.94,26.1)
USART1_RX: length 32.3
  Top Layer w0.203: v1(16.59,23.94) 17.25,23.94 arc(17.5,24.04) 17.6,24.29 17.6,26.21 arc(17.62,26.27) NOREF#15.4 ; NOREF#2.32 16.56,19.99 arc(16.59,20.01) v1(16.58,20.04) ; NOREF#2.32 15.39,19.96 ; NOREF#2.32 v1(14.17,19.99)
  Bottom Layer w0.203: v1(16.58,20.04) 16.58,23.93 v1(16.59,23.94) ; NOREF#18.6 8.67,5.69 arc(7.81,6.04) 7.46,6.89 7.46,12.92 arc(7.69,13.46) 8.23,13.69 9.18,13.69 arc(9.46,13.81) 9.58,14.09 9.58,18.54 arc(10,19.56) 11.02,19.98 14.16,19.98 arc(14.17,19.98) v1(14.17,19.99)
USART1_TX: length 33
  Top Layer w0.203: v1(13.82,19.49) NOREF#2.31 v1(17.12,19.49) ; v1(17.12,23.46) 19.76,23.46 arc(20.05,23.58) 20.17,23.87 20.17,26.28 arc(20.17,26.29) NOREF#15.3
  Bottom Layer w0.203: v1(17.12,23.46) v1(17.12,19.49) ; NOREF#18.7 8.46,6.96 arc(8.15,7.09) 8.02,7.4 8.02,12.81 arc(8.15,13.12) 8.46,13.25 9.51,13.25 arc(9.9,13.41) 10.06,13.8 10.06,18.37 arc(10.39,19.17) 11.19,19.5 13.81,19.5 arc(13.82,19.5) v1(13.82,19.49)
USB-D+: length 34.4
  Top Layer w0.203: 27.97,20.73 26.9,20.73 26.63,21 26.63,21.46 26.9,21.73 27.97,21.73
  Bottom Layer w0.203: v1(26.63,21.26) 27.29,21.26 arc(27.62,21.12) 27.76,20.78 27.76,20.73 ; 27.76,19.53 27.76,19.53 ; 27.76,19.53 27.76,19.53 arc(27.84,19.34) 28.03,19.26 29.04,19.26 29.99,18.31 29.99,15.12 31.17,13.94 31.17,8.82 30.16,7.81 17.81,7.81 17.4,8.23 NOREF#18.1 ; 27.76,19.53 27.76,20.73 ; 27.76,20.73 27.76,20.73
USB-D-: length 34.6
  Top Layer w0.203: 27.97,20.23 29.05,20.23 29.32,20.5 29.32,20.96 29.05,21.23 27.97,21.23
  Bottom Layer w0.203: NOREF#18.2 17.34,6.96 17.84,7.45 30.31,7.45 31.53,8.67 31.53,14.09 30.35,15.27 30.35,18.46 29.18,19.62 28.32,19.62 28.32,19.62 arc(28.18,19.67) 28.12,19.82 28.12,19.86 28.12,19.86 28.12,20.34 arc(28.24,20.64) 28.54,20.76 v1(29.32,20.76)

## Copper pours and planes (outline as drawn; the poured copper is in the pictures)
3V3 on Top Layer: 15.08,23.1 18.66,23.1 18.98,22.78 18.98,21.28 18.63,20.93 14.4,20.93 14.2,21.13 14.2,22.22
3V3 on Top Layer: 22.84,8.98 25.68,8.98 26.22,8.44 26.22,7.18 26.07,7.03 24.18,7.03 23.84,6.69 23.84,5.1 24.61,4.33 24.61,3.23 24.51,3.13 21.64,3.13 21.41,3.36 21.41,8.73 21.66,8.98 22.83,8.98
3V3 on Top Layer: 14.02,17.44 14.32,17.14 14.32,14.37 14.07,14.12 11.76,14.12 11.56,14.32 11.56,17.26 11.74,17.44
3V3 on Top Layer: 3.76,27.44 5.53,27.44 8.33,24.64 8.45,24.64 8.64,24.45 8.64,22.05 8.28,21.69 5.86,21.69 5.56,21.99 5.56,23.22 4.92,23.86 3.92,23.86 3.53,24.25 3.53,27.21
3V3 on Top Layer: 10.2,31.71 12.08,31.71 12.72,31.07 12.72,28.77 12.58,28.63 10.27,28.63 10.12,28.78 10.12,31.62 10.2,31.7
3V3 on Bottom Layer: 8.01,27.01 12.1,27.01 12.63,27.54 12.63,31.21 11.99,31.85 10.08,31.85 9.99,31.76 9.99,29.53 9.92,29.46 8.04,29.46 7.85,29.27 7.85,27.16 8.01,27
3V3 on Bottom Layer: 12.52,17.7 14.84,17.7 15.26,17.28 15.26,16.06 14.84,15.64 12.71,15.64 12.45,15.9 12.45,17.62 12.52,17.69
5V on Top Layer: 33.21,10.2 34.41,9 34.41,4.96 32.89,3.44 28.67,3.44 27.97,4.14 27.97,10.04 28.13,10.2
5V on Top Layer: 24.21,6.94 27.64,6.94 27.81,6.77 27.81,4.63 27.76,4.58 27.76,3.37 27.59,3.2 24.93,3.2 24.8,3.33 24.8,4.17 23.98,4.99 23.98,6.71
5V on Bottom Layer: 10.09,10.76 11.65,10.76 11.96,10.45 11.96,8.04 11.66,7.74 9.54,7.74 9.43,7.85 9.43,8.98 10,9.55 10,10.66 10.09,10.75
5V on Bottom Layer: 9.9,4.91 11.66,4.91 11.97,4.6 11.97,2.44 11.61,2.08 10.14,2.08 9.93,2.29 9.93,3.59 9.7,3.82 9.7,4.71
5V on Bottom Layer: 27.57,13.25 28.12,12.7 30.76,12.7 30.96,12.5 30.96,9.02 30.02,8.08 28,8.08 27.57,8.51 27.57,11.85 27.28,12.14 25.29,12.14 24.95,11.8 24.95,10.91 24.73,10.69 20.16,10.69 20.02,10.83 20.02,12.19 21.08,13.25
5V_IN on Top Layer: 24.07,29.31 25.98,29.31 26.92,28.37 26.92,23.93 27.06,23.79 28.56,23.79 28.82,23.53 28.82,23.12 28.69,22.99 24.23,22.99 23.81,23.41 23.81,29.05
5V_IN on Top Layer: 23.81,22.75 24.72,22.75 26.37,21.11 26.37,19.24 26.82,18.78 26.82,18.37 26.03,18.37 25.57,18.83 25.57,20.15 23.81,21.91
5V_IN on Top Layer: 27.29,23.75 33.27,23.75 34.37,22.65 34.37,11.76 33.18,10.57 29.28,10.57 29.28,16.03 29.73,16.48 29.73,17.58 29.09,18.22 27.28,18.22 27.04,18.46 27.04,18.89 27.17,19.02 28.97,19.02 29.57,19.62 29.57,21.48 29.28,21.77 29.28,22.49 28.84,22.93 27.47,22.93 27.27,23.13 27.27,23.64 27.25,23.66 27.25,23.7 27.29,23.74
GND on Top Layer: -0.81,36.67 36.89,36.67 36.89,-0.31 -0.81,-0.31
GND on Bottom Layer: -1.1,37.01 37.25,37.01 37.25,-0.56 -1.1,-0.56
$Q1_3 on Top Layer: 22.79,20.52 24.46,20.52 24.81,20.17 24.81,18.14 24.37,17.69 22.97,17.69 22.58,18.08 22.58,20.31
$Q1_3 on Bottom Layer: 22.65,18.92 24.59,18.92 24.91,18.6 24.91,16.97 24.65,16.71 23.4,16.71 23.2,16.51 23.2,15.8 23.45,15.55 24.31,15.55 24.86,15 24.86,13.62 24.61,13.37 19.88,13.37 19.5,13.75 19.5,15.2 19.96,15.65 21.57,15.65 21.77,15.85 21.77,18.57 22.12,18.92 22.65,18.92

Small or netless copper shapes (teardrops, artwork), in the pictures only: 2 on Top Layer

## Text on the board
Bottom Silkscreen Layer: 22R / 1206
Top Silkscreen Layer: GND | MOSI | MISO | CLK | SPI_LED | V2.0 | ZZU | Uae | 3V3 G IO CLK | 5V G T R
